# EAGLE schematic lia (EAGLE 6.1)

## Sheet 1 of 3
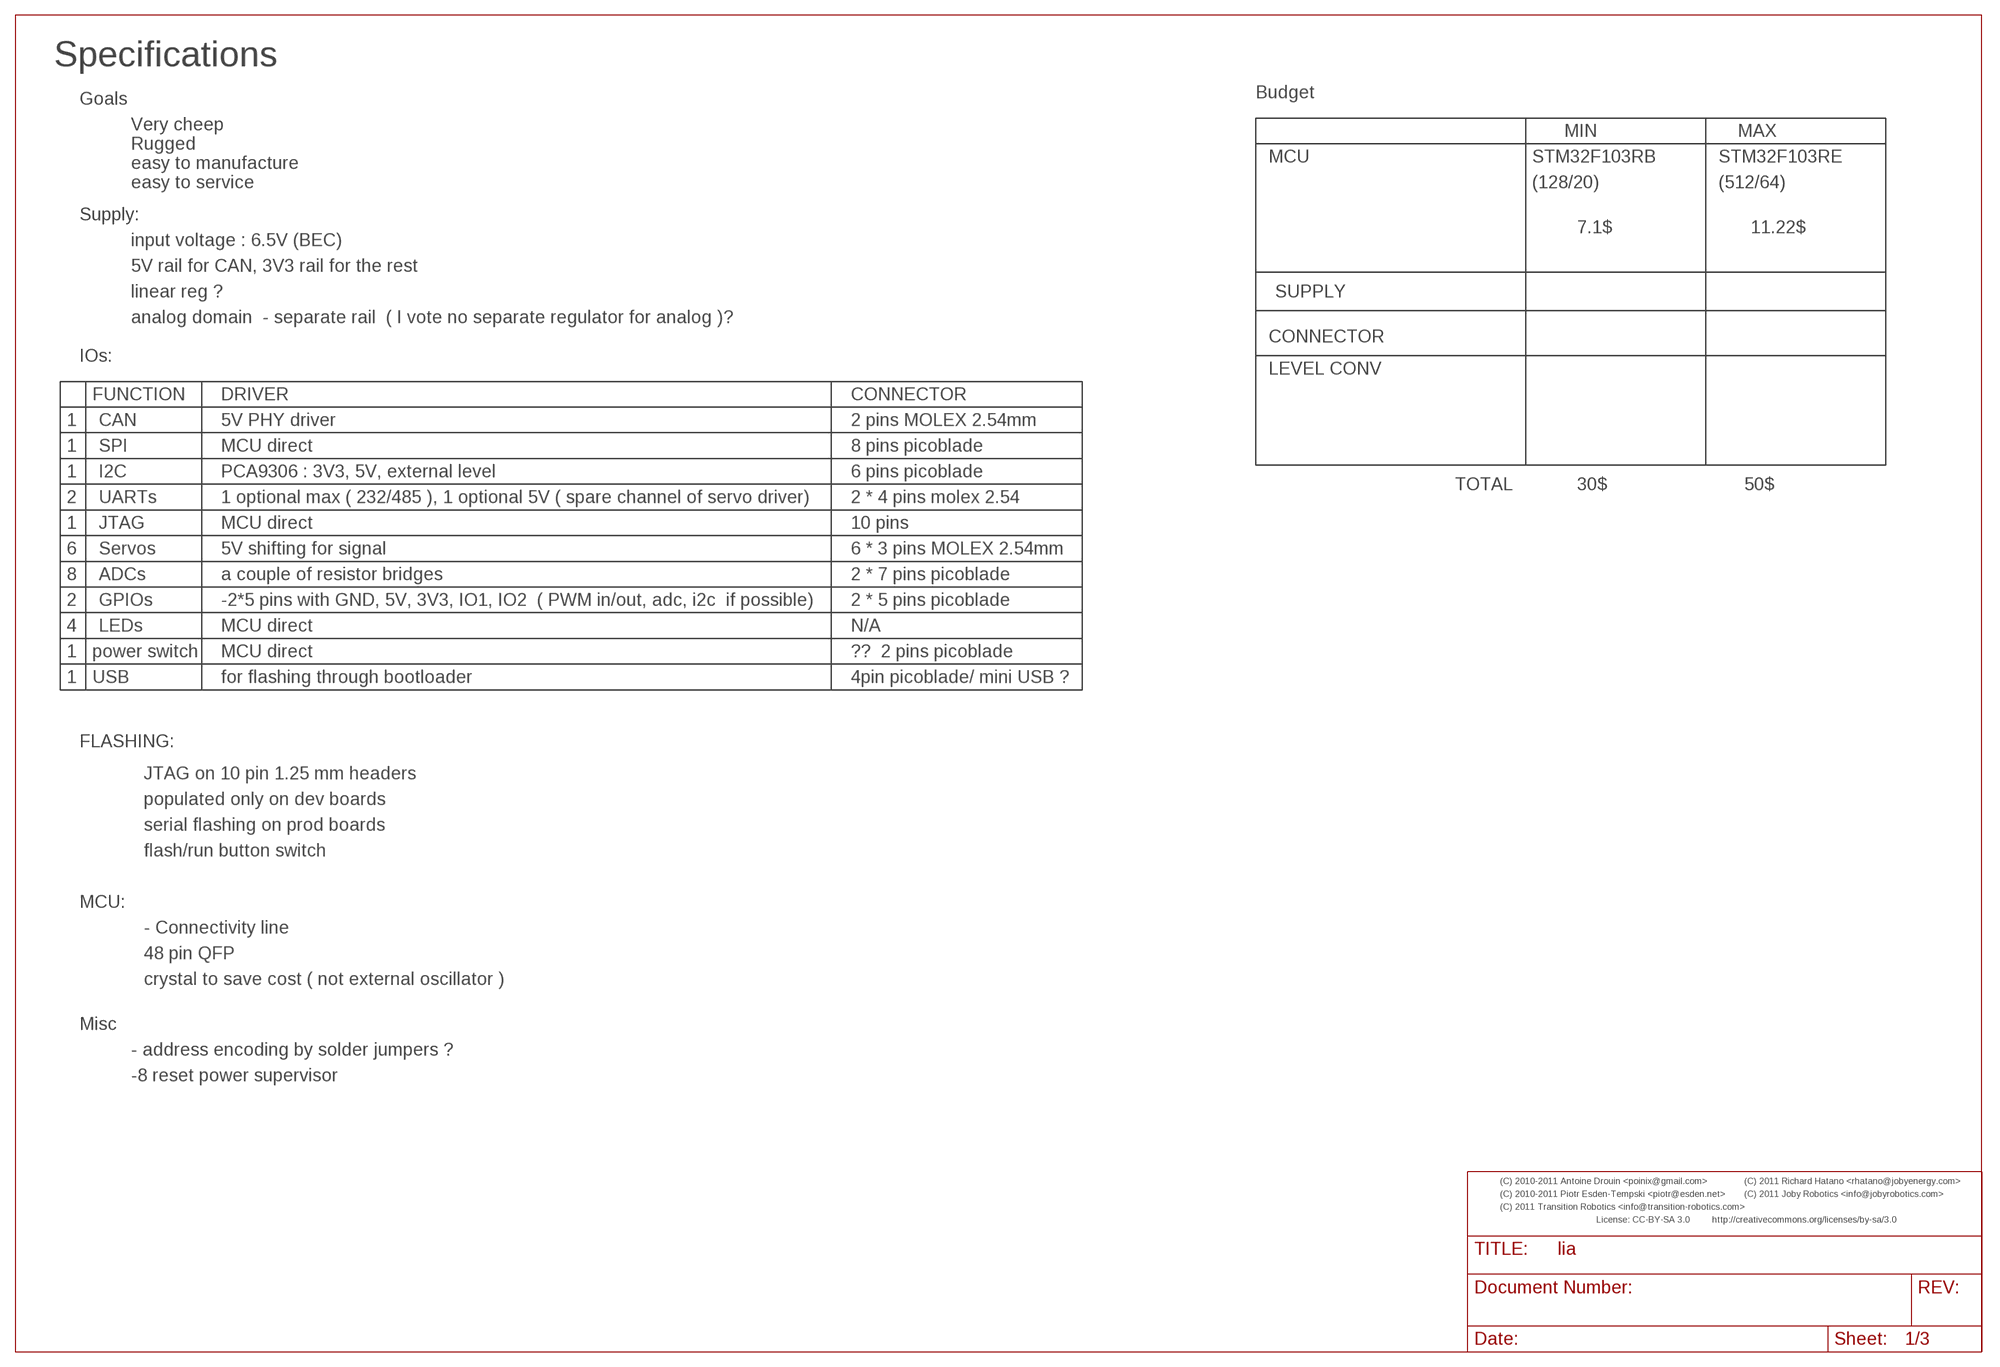
[diagram p0: schematic, sheet 1]

### Notes on the sheet
- Specifications
- Budget
- Goals
- Very cheep
- MIN | MAX
- Rugged
- MCU | STM32F103RB | STM32F103RE
- easy to manufacture
- easy to service | (128/20) | (512/64)
- Supply:
- 7.1$ | 11.22$
- input voltage : 6.5V (BEC)
- 5V rail for CAN, 3V3 rail for the rest
- linear reg ? | SUPPLY
- analog domain  - separate rail  ( I vote no separate regulator for analog )?
- CONNECTOR
- IOs:
- LEVEL CONV
- FUNCTION | DRIVER | CONNECTOR
- 1 | CAN | 5V PHY driver | 2 pins MOLEX 2.54mm
- 1 | SPI | MCU direct | 8 pins picoblade
- 1 | I2C | PCA9306 : 3V3, 5V, external level | 6 pins picoblade
- TOTAL | 30$ | 50$
- 2 | UARTs | 1 optional max ( 232/485 ), 1 optional 5V ( spare channel of servo driver) | 2 * 4 pins molex 2.54
- 1 | JTAG | MCU direct | 10 pins
- 6 | Servos | 5V shifting for signal | 6 * 3 pins MOLEX 2.54mm
- 8 | ADCs | a couple of resistor bridges | 2 * 7 pins picoblade
- 2 | GPIOs | -2*5 pins with GND, 5V, 3V3, IO1, IO2  ( PWM in/out, adc, i2c  if possible) | 2 * 5 pins picoblade
- 4 | LEDs | MCU direct | N/A
- 1 | power switch | MCU direct | ??  2 pins picoblade
- 1 | USB | for flashing through bootloader | 4pin picoblade/ mini USB ?
- FLASHING:
- JTAG on 10 pin 1.25 mm headers
- populated only on dev boards
- serial flashing on prod boards
- flash/run button switch
- MCU:
- - Connectivity line
- 48 pin QFP
- crystal to save cost ( not external oscillator )
- Misc
- - address encoding by solder jumpers ?
- -8 reset power supervisor
- (C) 2010-2011 Antoine Drouin <poinix@gmail.com> | (C) 2011 Richard Hatano <rhatano@jobyenergy.com>
- (C) 2010-2011 Piotr Esden-Tempski <piotr@esden.net> | (C) 2011 Joby Robotics <info@jobyrobotics.com>
- (C) 2011 Transition Robotics <info@transition-robotics.com>
- License: CC-BY-SA 3.0 | http://creativecommons.org/licenses/by-sa/3.0

## Sheet 2 of 3
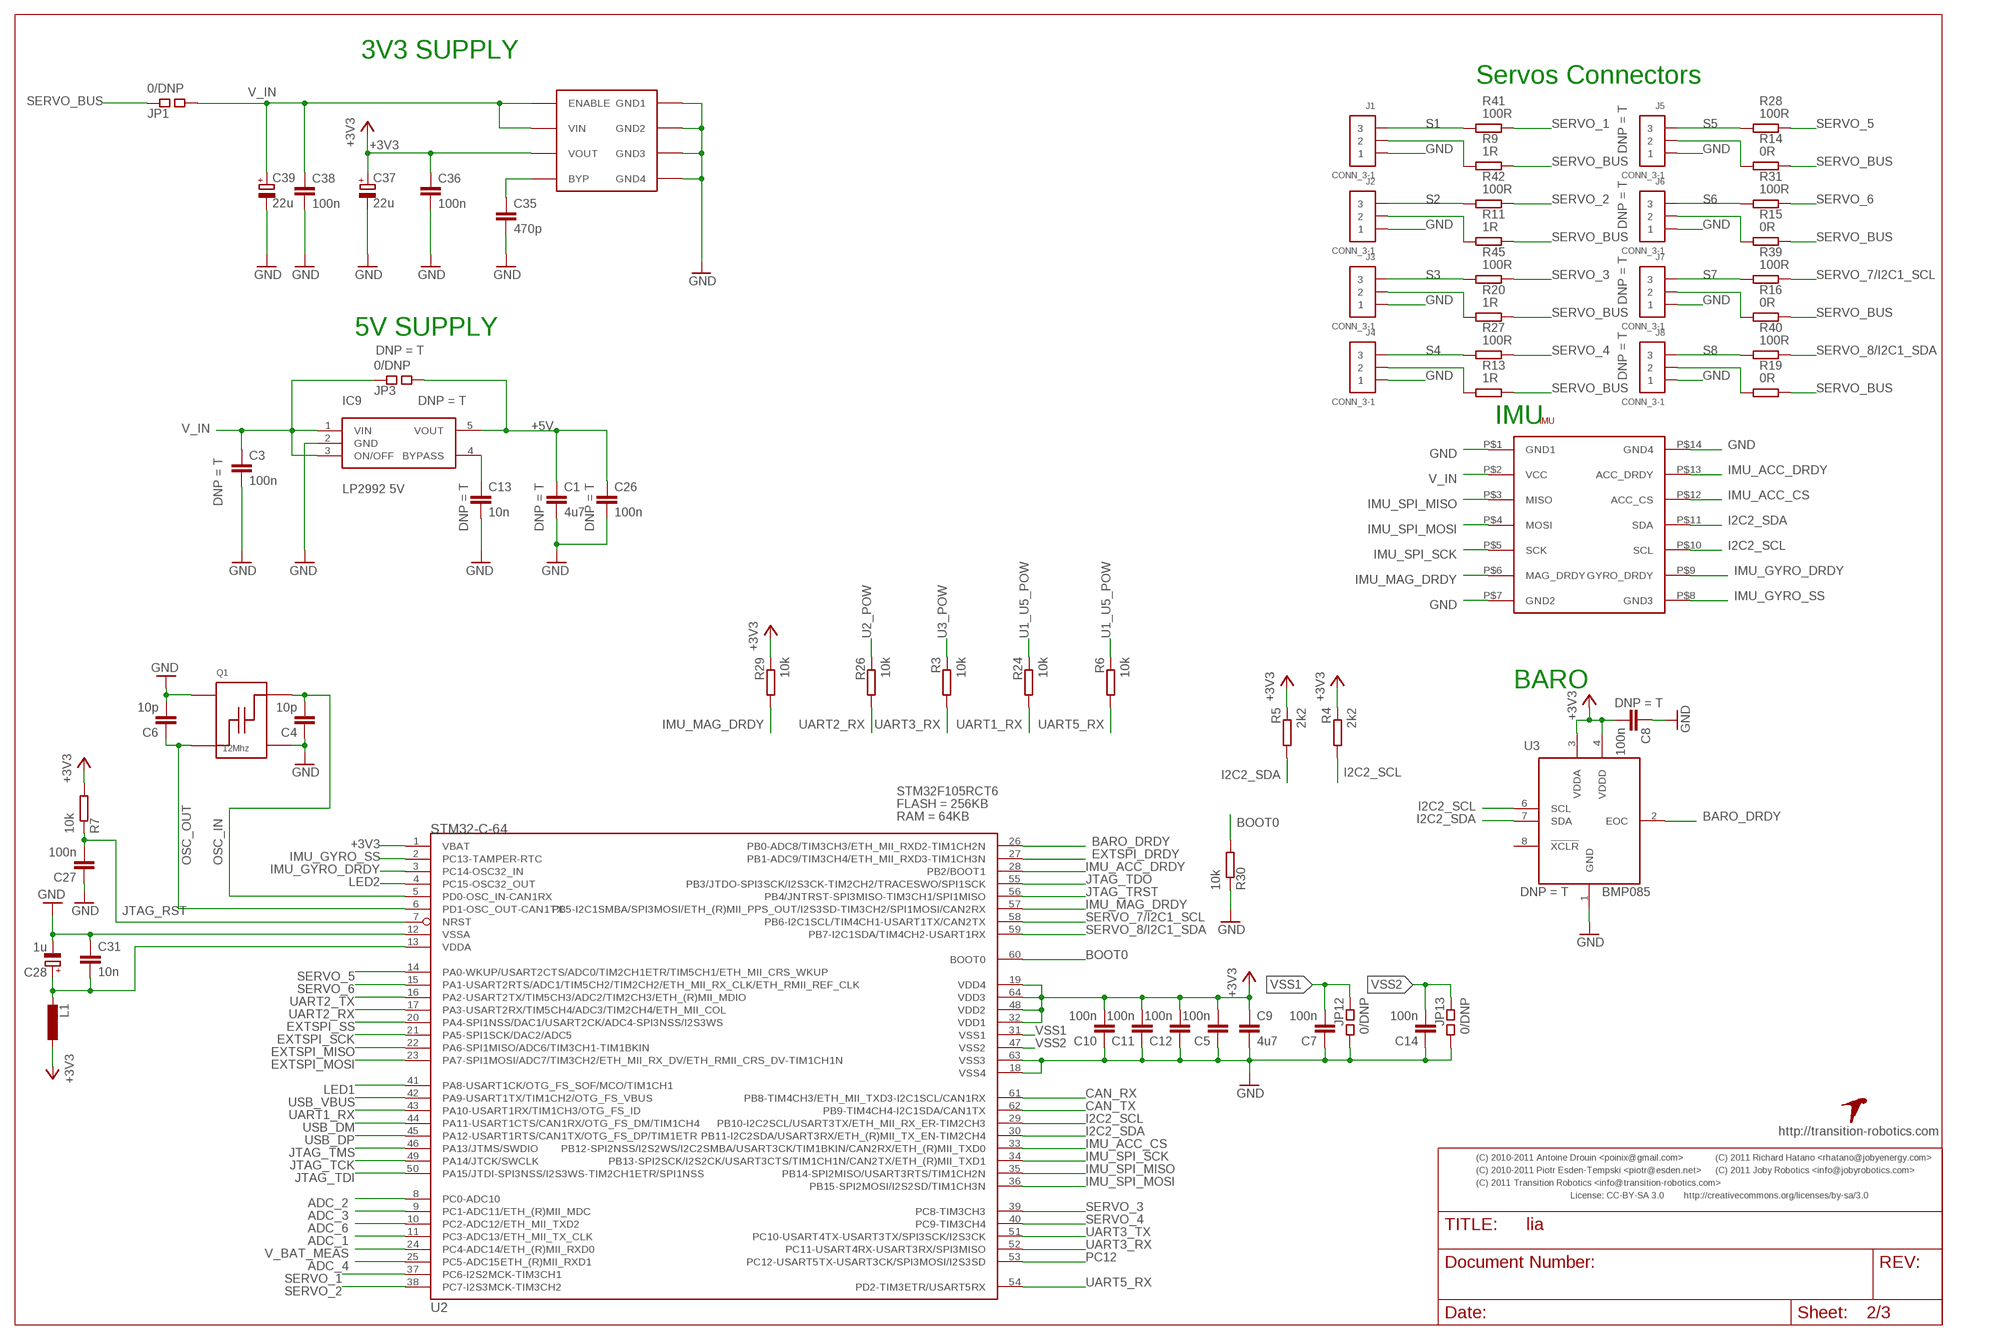
[diagram p1: schematic, sheet 2]

### Parts
C1  4u7  CAPACITOR-0805  [0805-CAP]
C3  100n  CAPACITOR-0603  [0603-CAP]
C4  10p  CAPACITOR-0402  [0402-CAP]
C5  100n  CAPACITOR-0402  [0402-CAP]
C6  10p  CAPACITOR-0402  [0402-CAP]
C7  100n  CAPACITOR-0402  [0402-CAP]
C8  100n  CAPACITOR-0402  [0402-CAP]
C9  4u7  CAPACITOR-0805  [0805-CAP]
C10  100n  CAPACITOR-0402  [0402-CAP]
C11  100n  CAPACITOR-0402  [0402-CAP]
C12  100n  CAPACITOR-0402  [0402-CAP]
C13  10n  CAPACITOR-0402  [0402-CAP]
C14  100n  CAPACITOR-0402  [0402-CAP]
C26  100n  CAPACITOR-0603  [0603-CAP]
C27  100n  CAPACITOR-0402  [0402-CAP]
C28  1u  CAPACITOR-POL-0603  [0603-POL-CAP]
C31  10n  CAPACITOR-0402  [0402-CAP]
C35  470p  CAPACITOR-0402  [0402-CAP]
C36  100n  CAPACITOR-0603  [0603-CAP]
C37  22u  CAPACITOR-POLB  [3528/B]
C38  100n  CAPACITOR-0402  [0402-CAP]
C39  22u  CAPACITOR-POLB  [3528/B]
IC9  LP2992 5V  LP2992  [SOT23-5]
IMU  ASPIRIN  [ASPIRIN_1]
J1  CONN_3-1  [SIP1X3_100]
J2  CONN_3-1  [SIP1X3_100]
J3  CONN_3-1  [SIP1X3_100]
J4  CONN_3-1  [SIP1X3_100]
J5  CONN_3-1  [SIP1X3_100]
J6  CONN_3-1  [SIP1X3_100]
J7  CONN_3-1  [SIP1X3_100]
J8  CONN_3-1  [SIP1X3_100]
JP1  0/DNP  SQ_JMP-0402  [0402-SQJMP]
JP3  0/DNP  SQ_JMP-0402  [0402-SQJMP]
JP12  0/DNP  SQ_JMP-0402  [0402-SQJMP]
JP13  0/DNP  SQ_JMP-0402  [0402-SQJMP]
L1  INDUCTOR-0603  [0603-IND]
Q1  12Mhz  ABM8  [ABM8]
R3  10k  RESISTOR-0402  [0402-RES]
R4  2k2  RESISTOR-0402  [0402-RES]
R5  2k2  RESISTOR-0402  [0402-RES]
R6  10k  RESISTOR-0402  [0402-RES]
R7  10k  RESISTOR-0402  [0402-RES]
R9  1R  RESISTOR-1206  [1206-RES]
R11  1R  RESISTOR-1206  [1206-RES]
R13  1R  RESISTOR-1206  [1206-RES]
R14  0R  RESISTOR-1206  [1206-RES]
R15  0R  RESISTOR-1206  [1206-RES]
R16  0R  RESISTOR-1206  [1206-RES]
R19  0R  RESISTOR-1206  [1206-RES]
R20  1R  RESISTOR-1206  [1206-RES]
R24  10k  RESISTOR-0402  [0402-RES]
R26  10k  RESISTOR-0402  [0402-RES]
R27  100R  RESISTOR-0402  [0402-RES]
R28  100R  RESISTOR-0402  [0402-RES]
R29  10k  RESISTOR-0402  [0402-RES]
R30  10k  RESISTOR-0402  [0402-RES]
R31  100R  RESISTOR-0402  [0402-RES]
R39  100R  RESISTOR-0402  [0402-RES]
R40  100R  RESISTOR-0402  [0402-RES]
R41  100R  RESISTOR-0402  [0402-RES]
R42  100R  RESISTOR-0402  [0402-RES]
R45  100R  RESISTOR-0402  [0402-RES]
U2  STM32-C-64  [LQFP64]
U3  BMP085  [LCC8]
U$1  TR-LOGO  [TR-LOGO]
VREG1  MIC5209  [SOIC8]

### Nets
+3V3: C5.P$2 C8.P$2 C9.P$1 C10.P$2 C11.P$2 C12.P$2 C36.P$1 C37.+ L1.P$1 R4.P$1 R5.P$1 R7.P$2 R29.P$1 U2.1(VBAT) U2.19(VDD4) U2.32(VDD1) U2.48(VDD2) U2.64(VDD3) U3.3(VDDA) U3.4(VDDD) VREG1.3(VOUT) ; also sheet 3
+5V: C1.P$1 C26.P$1 IC9.5(VOUT) JP3.P$2 ; also sheet 3
ADC_1: U2.11(PC3-ADC13/ETH_MII_TX_CLK) ; also sheet 3
ADC_2: U2.8(PC0-ADC10) ; also sheet 3
ADC_3: U2.9(PC1-ADC11/ETH_(R)MII_MDC) ; also sheet 3
ADC_4: U2.25(PC5-ADC15ETH_(R)MII_RXD1) ; also sheet 3
ADC_6: U2.10(PC2-ADC12/ETH_MII_TXD2) ; also sheet 3
BARO_DRDY: U2.26(PB0-ADC8/TIM3CH3/ETH_MII_RXD2-TIM1CH2N) U3.2(EOC)
BOOT0: R30.P$2 U2.60(BOOT0) ; also sheet 3
CAN_RX: U2.61(PB8-TIM4CH3/ETH_MII_TXD3-I2C1SCL/CAN1RX) ; also sheet 3
CAN_TX: U2.62(PB9-TIM4CH4-I2C1SDA/CAN1TX) ; also sheet 3
EXTSPI_DRDY: U2.27(PB1-ADC9/TIM3CH4/ETH_MII_RXD3-TIM1CH3N) ; also sheet 3
EXTSPI_MISO: U2.22(PA6-SPI1MISO/ADC6/TIM3CH1-TIM1BKIN) ; also sheet 3
EXTSPI_MOSI: U2.23(PA7-SPI1MOSI/ADC7/TIM3CH2/ETH_MII_RX_DV/ETH_RMII_CRS_DV-TIM1CH1N) ; also sheet 3
EXTSPI_SCK: U2.21(PA5-SPI1SCK/DAC2/ADC5) ; also sheet 3
EXTSPI_SS: U2.20(PA4-SPI1NSS/DAC1/USART2CK/ADC4-SPI3NSS/I2S3WS) ; also sheet 3
GND: C1.P$2 C3.P$2 C4.P$1 C5.P$1 C6.P$2 C7.P$1 C8.P$1 C9.P$2 C10.P$1 C11.P$1 C12.P$1 C13.P$2 C14.P$1 C26.P$2 C27.P$1 C28.- C31.P$1 C35.P$2 C36.P$2 C37.- C38.P$2 C39.- IC9.2(GND) IMU.P$1(GND1) IMU.P$7(GND2) IMU.P$14(GND4) J1.1 J2.1 J3.1 J4.1 J5.1 J6.1 J7.1 J8.1 JP12.P$2 JP13.P$2 Q1.P$2 Q1.P$4 R30.P$1 U2.12(VSSA) U2.18(VSS4) U2.63(VSS3) U3.1(GND) VREG1.5(GND4) VREG1.6(GND3) VREG1.7(GND2) VREG1.8(GND1) ; also sheet 3
I2C2_SCL: IMU.P$10(SCL) R4.P$2 U2.29(PB10-I2C2SCL/USART3TX/ETH_MII_RX_ER-TIM2CH3) U3.6(SCL) ; also sheet 3
I2C2_SDA: IMU.P$11(SDA) R5.P$2 U2.30(PB11-I2C2SDA/USART3RX/ETH_(R)MII_TX_EN-TIM2CH4) U3.7(SDA) ; also sheet 3
IMU_ACC_CS: IMU.P$12(ACC_CS) U2.33(PB12-SPI2NSS/I2S2WS/I2C2SMBA/USART3CK/TIM1BKIN/CAN2RX/ETH_(R)MII_TXD0)
IMU_ACC_DRDY: IMU.P$13(ACC_DRDY) U2.28(PB2/BOOT1)
IMU_GYRO_DRDY: IMU.P$9(GYRO_DRDY) U2.3(PC14-OSC32_IN)
IMU_GYRO_SS: IMU.P$8(GND3) U2.2(PC13-TAMPER-RTC)
IMU_MAG_DRDY: IMU.P$6(MAG_DRDY) R29.P$2 U2.57(PB5-I2C1SMBA/SPI3MOSI/ETH_(R)MII_PPS_OUT/I2S3SD-TIM3CH2/SPI1MOSI/CAN2RX)
IMU_SPI_MISO: IMU.P$3(MISO) U2.35(PB14-SPI2MISO/USART3RTS/TIM1CH2N)
IMU_SPI_MOSI: IMU.P$4(MOSI) U2.36(PB15-SPI2MOSI/I2S2SD/TIM1CH3N)
IMU_SPI_SCK: IMU.P$5(SCK) U2.34(PB13-SPI2SCK/I2S2CK/USART3CTS/TIM1CH1N/CAN2TX/ETH_(R)MII_TXD1)
JTAG_RST: C27.P$2 R7.P$1 U2.7(NRST) ; also sheet 3
JTAG_TCK: U2.49(PA14/JTCK/SWCLK) ; also sheet 3
JTAG_TDI: U2.50(PA15/JTDI-SPI3NSS/I2S3WS-TIM2CH1ETR/SPI1NSS) ; also sheet 3
JTAG_TDO: U2.55(PB3/JTDO-SPI3SCK/I2S3CK-TIM2CH2/TRACESWO/SPI1SCK) ; also sheet 3
JTAG_TMS: U2.46(PA13/JTMS/SWDIO) ; also sheet 3
JTAG_TRST: U2.56(PB4/JNTRST-SPI3MISO-TIM3CH1/SPI1MISO) ; also sheet 3
LED1: U2.41(PA8-USART1CK/OTG_FS_SOF/MCO/TIM1CH1) ; also sheet 3
LED2: U2.4(PC15-OSC32_OUT) ; also sheet 3
N$2: J5.2 R14.P$1
N$3: J6.2 R15.P$1
N$6: C13.P$1 IC9.4(BYPASS)
N$7: C35.P$1 VREG1.4(BYP)
N$16: J7.2 R16.P$1
N$17: J8.2 R19.P$1
N$18: J4.2 R13.P$1
N$19: J3.2 R20.P$1
N$20: J2.2 R11.P$1
N$21: J1.2 R9.P$1
OSC_IN: C4.P$2 Q1.P$3 U2.5(PD0-OSC_IN-CAN1RX)
OSC_OUT: C6.P$1 Q1.P$1 U2.6(PD1-OSC_OUT-CAN1TX)
PC12: U2.53(PC12-USART5TX-USART3CK/SPI3MOSI/I2S3SD) ; also sheet 3
S1: J1.3 R41.P$1
S2: J2.3 R42.P$1
S3: J3.3 R45.P$1
S4: J4.3 R27.P$1
S5: J5.3 R28.P$1
S6: J6.3 R31.P$1
S7: J7.3 R39.P$1
S8: J8.3 R40.P$1
SERVO_1: R41.P$2 U2.37(PC6-I2S2MCK-TIM3CH1)
SERVO_2: R42.P$2 U2.38(PC7-I2S3MCK-TIM3CH2)
SERVO_3: R45.P$2 U2.39(PC8-TIM3CH3)
SERVO_4: R27.P$2 U2.40(PC9-TIM3CH4)
SERVO_5: R28.P$2 U2.14(PA0-WKUP/USART2CTS/ADC0/TIM2CH1ETR/TIM5CH1/ETH_MII_CRS_WKUP)
SERVO_6: R31.P$2 U2.15(PA1-USART2RTS/ADC1/TIM5CH2/TIM2CH2/ETH_MII_RX_CLK/ETH_RMII_REF_CLK)
SERVO_7/I2C1_SCL: R39.P$2 U2.58(PB6-I2C1SCL/TIM4CH1-USART1TX/CAN2TX) ; also sheet 3
SERVO_8/I2C1_SDA: R40.P$2 U2.59(PB7-I2C1SDA/TIM4CH2-USART1RX) ; also sheet 3
SERVO_BUS: JP1.P$1 R9.P$2 R11.P$2 R13.P$2 R14.P$2 R15.P$2 R16.P$2 R19.P$2 R20.P$2
U1_U5_POW: R6.P$1 R24.P$1 ; also sheet 3
U2_POW: R26.P$1 ; also sheet 3
U3_POW: R3.P$1 ; also sheet 3
UART1_RX: R24.P$2 U2.43(PA10-USART1RX/TIM1CH3/OTG_FS_ID) ; also sheet 3
UART2_RX: R26.P$2 U2.17(PA3-USART2RX/TIM5CH4/ADC3/TIM2CH4/ETH_MII_COL) ; also sheet 3
UART2_TX: U2.16(PA2-USART2TX/TIM5CH3/ADC2/TIM2CH3/ETH_(R)MII_MDIO) ; also sheet 3
UART3_RX: R3.P$2 U2.52(PC11-USART4RX-USART3RX/SPI3MISO) ; also sheet 3
UART3_TX: U2.51(PC10-USART4TX-USART3TX/SPI3SCK/I2S3CK) ; also sheet 3
UART5_RX: R6.P$2 U2.54(PD2-TIM3ETR/USART5RX) ; also sheet 3
USB_DM: U2.44(PA11-USART1CTS/CAN1RX/OTG_FS_DM/TIM1CH4) ; also sheet 3
USB_DP: U2.45(PA12-USART1RTS/CAN1TX/OTG_FS_DP/TIM1ETR) ; also sheet 3
USB_VBUS: U2.42(PA9-USART1TX/TIM1CH2/OTG_FS_VBUS) ; also sheet 3
V_BAT_MEAS: U2.24(PC4-ADC14/ETH_(R)MII_RXD0) ; also sheet 3
V_IN: C3.P$1 C38.P$1 C39.+ IC9.1(VIN) IC9.3(ON/OFF) IMU.P$2(VCC) JP1.P$2 JP3.P$1 VREG1.1(ENABLE) VREG1.2(VIN) ; also sheet 3
VDDA: C28.+ C31.P$2 L1.P$2 U2.13(VDDA)
VSS1: C7.P$2 JP12.P$1 U2.31(VSS1)
VSS2: C14.P$2 JP13.P$1 U2.47(VSS2)
Unconnected: U3.8(!XCLR)

### Notes on the sheet
- 3V3 SUPPLY
- Servos Connectors
- 5V SUPPLY
- IMU
- BARO
- http://transition-robotics.com
- (C) 2010-2011 Antoine Drouin <poinix@gmail.com> | (C) 2011 Richard Hatano <rhatano@jobyenergy.com>
- (C) 2010-2011 Piotr Esden-Tempski <piotr@esden.net> | (C) 2011 Joby Robotics <info@jobyrobotics.com>
- (C) 2011 Transition Robotics <info@transition-robotics.com>
- License: CC-BY-SA 3.0 | http://creativecommons.org/licenses/by-sa/3.0

## Sheet 3 of 3
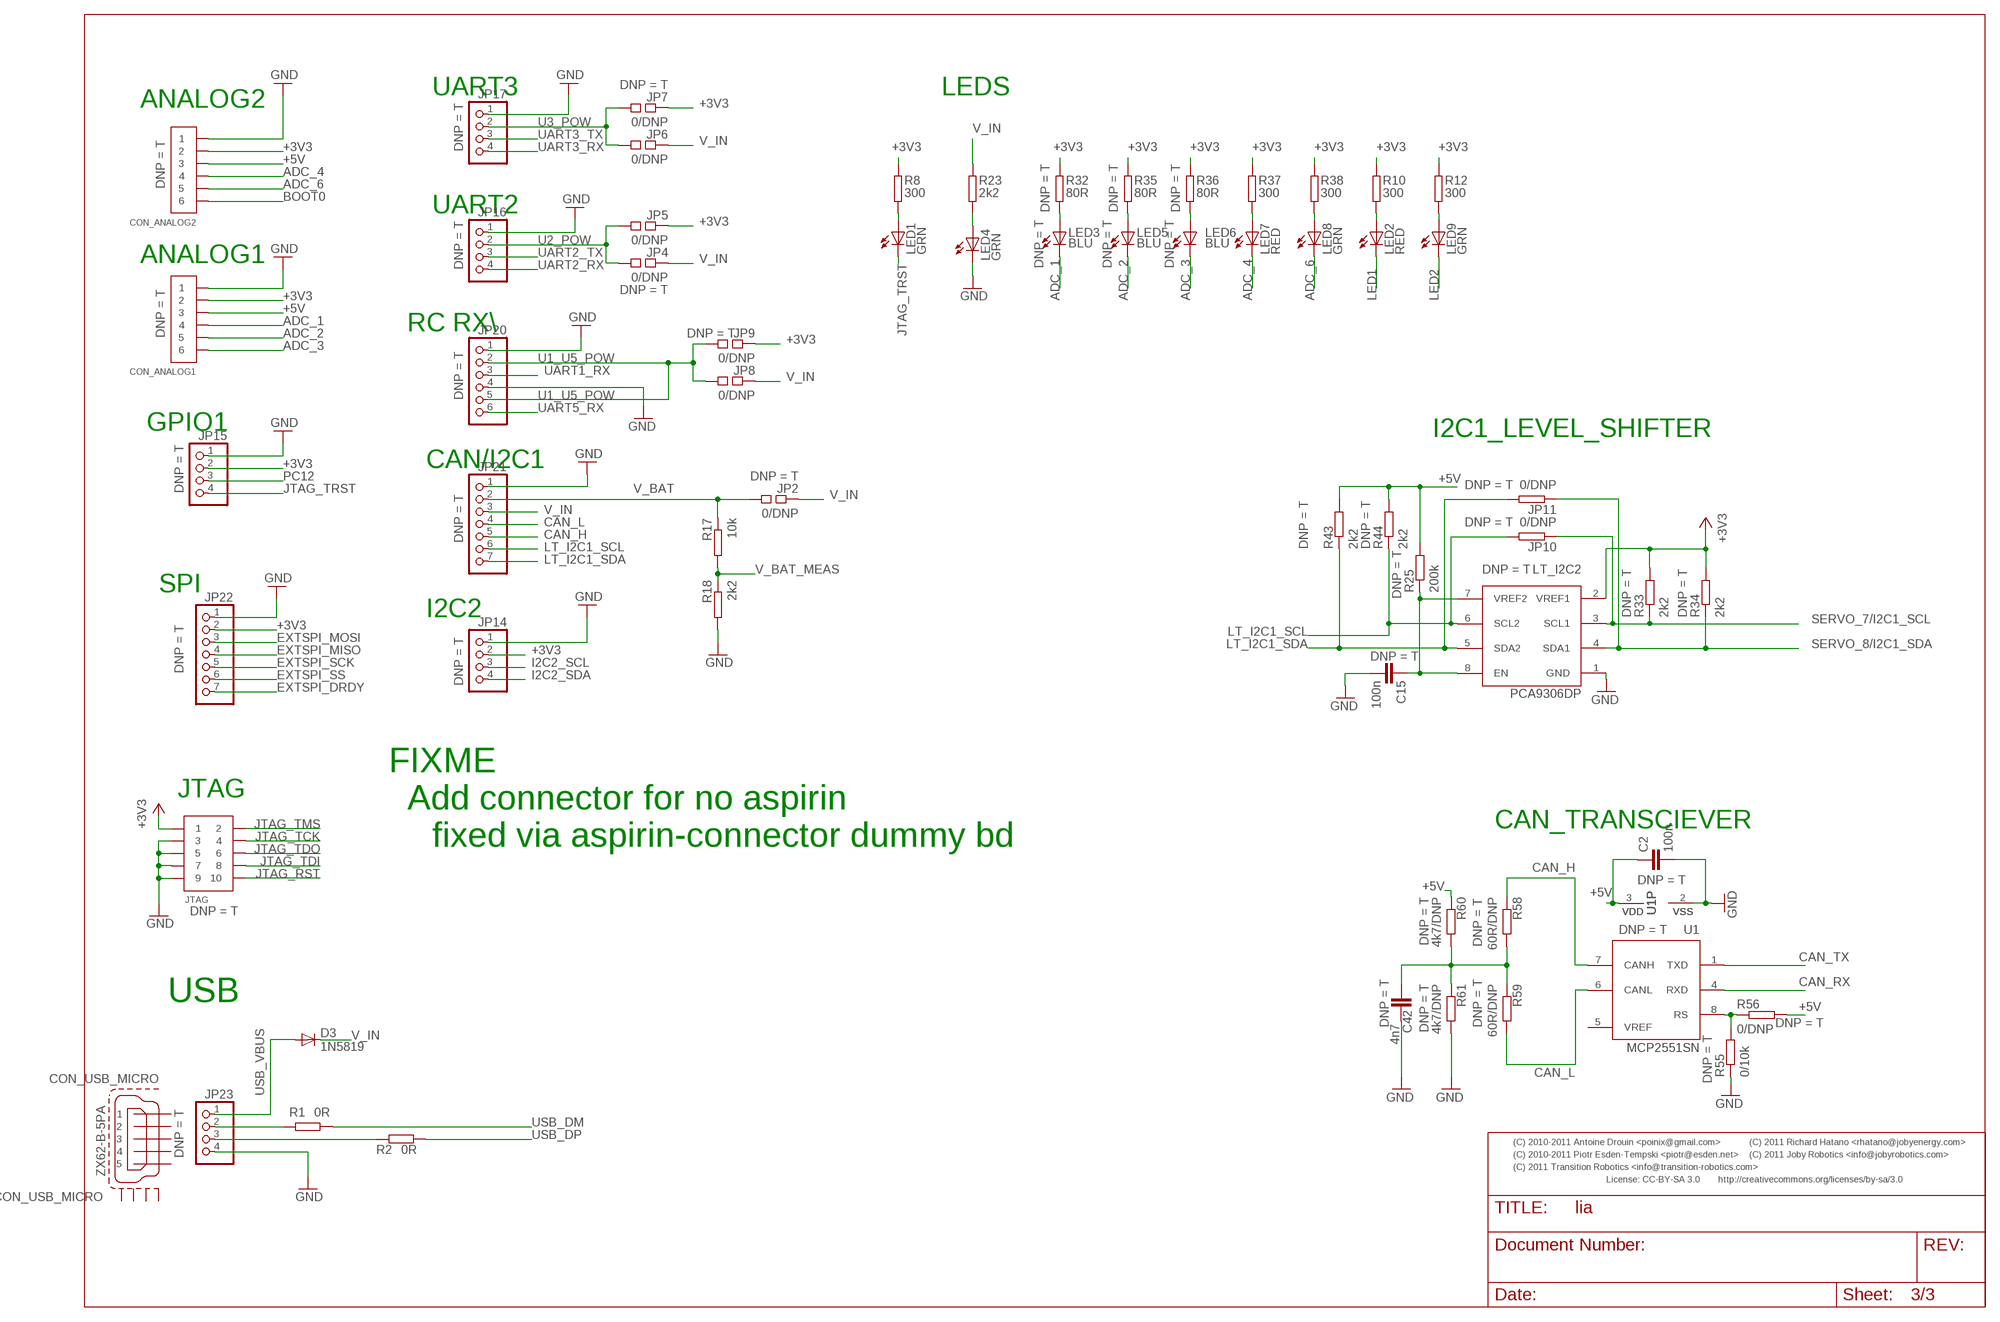
[diagram p2: schematic, sheet 3]

### Parts
C2  100n  CAPACITOR-0402  [0402-CAP]
C15  100n  CAPACITOR-0402  [0402-CAP]
C42  4n7  CAPACITOR-0603  [0603-CAP]
CON_ANALOG1  CONN_6-1-53398  [PB-53398-06]
CON_ANALOG2  CONN_6-1-53398  [PB-53398-06]
CON_USB_MICRO  ZX62-B-5PA  [ZX62-B-5PA]
D3  1N5819  DIODE-MICROMELF-R  [MICROMELF-R]
JP2  0/DNP  SQ_JMP-0402  [0402-SQJMP]
JP4  0/DNP  SQ_JMP-0402  [0402-SQJMP]
JP5  0/DNP  SQ_JMP-0402  [0402-SQJMP]
JP6  0/DNP  SQ_JMP-0402  [0402-SQJMP]
JP7  0/DNP  SQ_JMP-0402  [0402-SQJMP]
JP8  0/DNP  SQ_JMP-0402  [0402-SQJMP]
JP9  0/DNP  SQ_JMP-0402  [0402-SQJMP]
JP10  0/DNP  RESISTOR-0603  [0603-RES]
JP11  0/DNP  RESISTOR-0603  [0603-RES]
JP14  PINHD-1X4  [1X04]
JP15  PINHD-1X4  [1X04]
JP16  PINHD-1X4  [1X04]
JP17  PINHD-1X4  [1X04]
JP20  PINHD-1X6  [1X06]
JP21  PINHD-1X7  [1X07]
JP22  PINHD-1X7  [1X07]
JP23  PINHD-1X4  [1X04]
JTAG  PIN_HDR_EDG_1.27MM_5-2  CONN_5-2-FTSH-V  [FTSH-105-DV]
LED1  GRN  LED-0402  [0402-LED]
LED2  RED  LED-0402  [0402-LED]
LED3  BLU  LED-0402  [0402-LED]
LED4  GRN  LED-0402  [0402-LED]
LED5  BLU  LED-0402  [0402-LED]
LED6  BLU  LED-0402  [0402-LED]
LED7  RED  LED-0402  [0402-LED]
LED8  GRN  LED-0402  [0402-LED]
LED9  GRN  LED-0402  [0402-LED]
LT_I2C2  PCA9306DP  [TSSOP_B3]
R1  0R  RESISTOR-0402  [0402-RES]
R2  0R  RESISTOR-0402  [0402-RES]
R8  300  RESISTOR-0402  [0402-RES]
R10  300  RESISTOR-0402  [0402-RES]
R12  300  RESISTOR-0402  [0402-RES]
R17  10k  RESISTOR-0402  [0402-RES]
R18  2k2  RESISTOR-0402  [0402-RES]
R23  2k2  RESISTOR-0402  [0402-RES]
R25  200k  RESISTOR-0402  [0402-RES]
R32  80R  RESISTOR-0402  [0402-RES]
R33  2k2  RESISTOR-0402  [0402-RES]
R34  2k2  RESISTOR-0402  [0402-RES]
R35  80R  RESISTOR-0402  [0402-RES]
R36  80R  RESISTOR-0402  [0402-RES]
R37  300  RESISTOR-0402  [0402-RES]
R38  300  RESISTOR-0402  [0402-RES]
R43  2k2  RESISTOR-0402  [0402-RES]
R44  2k2  RESISTOR-0402  [0402-RES]
R55  0/10k  RESISTOR-0402  [0402-RES]
R56  0/DNP  RESISTOR-0402  [0402-RES]
R58  60R/DNP  RESISTOR-0402  [0402-RES]
R59  60R/DNP  RESISTOR-0402  [0402-RES]
R60  4k7/DNP  RESISTOR-0402  [0402-RES]
R61  4k7/DNP  RESISTOR-0402  [0402-RES]
U1  MCP2551SN  [SO-08]

### Nets
+3V3: CON_ANALOG1.2 CON_ANALOG2.2 JP5.P$1 JP7.P$1 JP9.P$1 JP14.2 JP15.2 JP22.2 JTAG.1 LT_I2C2.2(VREF1) R8.P$2 R10.P$2 R12.P$2 R32.P$2 R33.P$2 R34.P$2 R35.P$2 R36.P$2 R37.P$2 R38.P$2 ; also sheet 2
+5V: C2.P$1 CON_ANALOG1.3 CON_ANALOG2.3 R25.P$2 R43.P$2 R44.P$2 R56.P$2 R60.P$1 U1.3(VDD) ; also sheet 2
ADC_1: CON_ANALOG1.4 LED3.C ; also sheet 2
ADC_2: CON_ANALOG1.5 LED5.C ; also sheet 2
ADC_3: CON_ANALOG1.6 LED6.C ; also sheet 2
ADC_4: CON_ANALOG2.4 LED7.C ; also sheet 2
ADC_6: CON_ANALOG2.5 LED8.C ; also sheet 2
BOOT0: CON_ANALOG2.6 ; also sheet 2
CAN_CENTER: C42.P$2 R58.P$2 R59.P$1 R60.P$2 R61.P$1
CAN_H: JP21.5 R58.P$1 U1.7(CANH)
CAN_L: JP21.4 R59.P$2 U1.6(CANL)
CAN_RX: U1.4(RXD) ; also sheet 2
CAN_TX: U1.1(TXD) ; also sheet 2
EXTSPI_DRDY: JP22.7 ; also sheet 2
EXTSPI_MISO: JP22.4 ; also sheet 2
EXTSPI_MOSI: JP22.3 ; also sheet 2
EXTSPI_SCK: JP22.5 ; also sheet 2
EXTSPI_SS: JP22.6 ; also sheet 2
FT_USB_DM: JP23.2 R1.P$1
FT_USB_DP: JP23.3 R2.P$1
GND: C2.P$2 C15.P$2 C42.P$1 CON_ANALOG1.1 CON_ANALOG2.1 JP14.1 JP15.1 JP16.1 JP17.1 JP20.1 JP20.4 JP21.1 JP22.1 JP23.4 JTAG.3 JTAG.5 JTAG.7 JTAG.9 LED4.C LT_I2C2.1(GND) R18.P$2 R55.P$1 R61.P$2 U1.2(VSS) ; also sheet 2
I2C2_SCL: JP14.3 ; also sheet 2
I2C2_SDA: JP14.4 ; also sheet 2
JTAG_RST: JTAG.10 ; also sheet 2
JTAG_TCK: JTAG.4 ; also sheet 2
JTAG_TDI: JTAG.8 ; also sheet 2
JTAG_TDO: JTAG.6 ; also sheet 2
JTAG_TMS: JTAG.2 ; also sheet 2
JTAG_TRST: JP15.4 LED1.C ; also sheet 2
LED1: LED2.C ; also sheet 2
LED2: LED9.C ; also sheet 2
LT_I2C1_SCL: JP10.P$2 JP21.6 LT_I2C2.6(SCL2) R44.P$1
LT_I2C1_SDA: JP11.P$2 JP21.7 LT_I2C2.5(SDA2) R43.P$1
N$1: R55.P$2 R56.P$1 U1.8(RS)
N$4: LED2.A R10.P$1
N$5: LED3.A R32.P$1
N$8: C15.P$1 LT_I2C2.7(VREF2) LT_I2C2.8(EN) R25.P$1
N$9: LED5.A R35.P$1
N$10: LED1.A R8.P$1
N$11: LED6.A R36.P$1
N$12: LED4.A R23.P$1
N$13: LED9.A R12.P$1
N$14: LED7.A R37.P$1
N$15: LED8.A R38.P$1
PC12: JP15.3 ; also sheet 2
SERVO_7/I2C1_SCL: JP10.P$1 LT_I2C2.3(SCL1) R33.P$1 ; also sheet 2
SERVO_8/I2C1_SDA: JP11.P$1 LT_I2C2.4(SDA1) R34.P$1 ; also sheet 2
U1_U5_POW: JP8.P$2 JP9.P$2 JP20.2 JP20.5 ; also sheet 2
U2_POW: JP4.P$2 JP5.P$2 JP16.2 ; also sheet 2
U3_POW: JP6.P$2 JP7.P$2 JP17.2 ; also sheet 2
UART1_RX: JP20.3 ; also sheet 2
UART2_RX: JP16.4 ; also sheet 2
UART2_TX: JP16.3 ; also sheet 2
UART3_RX: JP17.4 ; also sheet 2
UART3_TX: JP17.3 ; also sheet 2
UART5_RX: JP20.6 ; also sheet 2
USB_DM: R1.P$2 ; also sheet 2
USB_DP: R2.P$2 ; also sheet 2
USB_VBUS: D3.A JP23.1 ; also sheet 2
V_BAT: JP2.P$2 JP21.2 R17.P$1
V_BAT_MEAS: R17.P$2 R18.P$1 ; also sheet 2
V_IN: D3.C JP2.P$1 JP4.P$1 JP6.P$1 JP8.P$1 JP21.3 R23.P$2 ; also sheet 2
Unconnected: CON_USB_MICRO.GND_LEFT(S1) CON_USB_MICRO.GND_RIGHT(S2) CON_USB_MICRO.GND_UP_LEFT(S3) CON_USB_MICRO.GND_UP_RIGHT(S4) CON_USB_MICRO.PIN_1 CON_USB_MICRO.PIN_2 CON_USB_MICRO.PIN_3 CON_USB_MICRO.PIN_4 CON_USB_MICRO.PIN_5

### Notes on the sheet
- ANALOG2 | UART3 | LEDS
- UART2
- ANALOG1
- RC RX\
- GPIO1 | I2C1_LEVEL_SHIFTER
- CAN/I2C1
- SPI
- I2C2
- FIXME
- JTAG
- Add connector for no aspirin
- CAN_TRANSCIEVER
- fixed via aspirin-connector dummy bd
- USB
- (C) 2010-2011 Antoine Drouin <poinix@gmail.com> | (C) 2011 Richard Hatano <rhatano@jobyenergy.com>
- (C) 2010-2011 Piotr Esden-Tempski <piotr@esden.net> | (C) 2011 Joby Robotics <info@jobyrobotics.com>
- (C) 2011 Transition Robotics <info@transition-robotics.com>
- License: CC-BY-SA 3.0 | http://creativecommons.org/licenses/by-sa/3.0

## Power pins joined to a net without a drawn wire
VREF: U1.5(VREF)

## Library data of the parts
C1 = pel_dipol_comp:CAPACITOR; DNP: T; PARTNO: cap-cer-0805-4u7
C2 C8 C15 = pel_dipol_comp:CAPACITOR; DNP: T; PARTNO: cap-cer-0402-100n
C3 C26 = pel_dipol_comp:CAPACITOR; DNP: T; PARTNO: cap-cer-0603-100n
C4 C6 = pel_dipol_comp:CAPACITOR; PARTNO: cap-cer-0402-10p
C5 C7 C10-C12 C14 C27 C38 = pel_dipol_comp:CAPACITOR; PARTNO: cap-cer-0402-100n
C9 = pel_dipol_comp:CAPACITOR; PARTNO: cap-cer-0805-4u7
C13 = pel_dipol_comp:CAPACITOR; DNP: T; PARTNO: cap-cer-0402-10n
C28 = pel_dipol_comp:CAPACITOR-POL; PARTNO: cap-tan-0603-1u
C31 = pel_dipol_comp:CAPACITOR; PARTNO: cap-cer-0402-10n
C35 = pel_dipol_comp:CAPACITOR; PARTNO: cap-cer-0402-470p
C36 = pel_dipol_comp:CAPACITOR; PARTNO: cap-cer-0603-100n
C37 C39 = pel_dipol_comp:CAPACITOR-POL; PARTNO: cap-tan-B-22u-16v
C42 = pel_dipol_comp:CAPACITOR; DNP: T; PARTNO: cap-cer-0603-4n7
CON_ANALOG1 CON_ANALOG2 = pel_molex:CONN_6-1; DNP: T; PARTNO: conn-picoblade-smd-0.05in-6-vert
CON_USB_MICRO = open-bldc:ZX62-B-5PA; PARTNO: conn-smd-usb-micro-b
D3 = diode:DIODE-: DIODE; PARTNO: diode-schottky-1608
IC9 = open-bldc:LP2992; DNP: T; PARTNO: vreg-sot-23-5-5v
IMU = joby_robotics:ASPIRIN; PARTNO: pcb-ass-aspirin
J1-J4 = pel_misc:CONN_3-1; PARTNO: conn-th-0.1in-3-2-ra
J5-J8 = pel_misc:CONN_3-1; DNP: T; PARTNO: conn-th-0.1in-3-2-ra
JP1 JP5 JP6 JP8 JP12 JP13 = pel_jumpers:SQ_JMP; PARTNO: res-0402-0
JP2-JP4 JP7 JP9 = pel_jumpers:SQ_JMP; DNP: T; PARTNO: res-0402-0
JP10 JP11 = pel_dipol_comp:RESISTOR; DNP: T; PARTNO: res-0603-0
JP14-JP17 JP23 = pinhead:PINHD-1X4: PIN HEADER; DNP: T; PARTNO: conn-th-0.1in-4-1
JP20 = pinhead:PINHD-1X6: PIN HEADER; DNP: T; PARTNO: conn-th-0.1in-6-1
JP21 JP22 = pinhead:PINHD-1X7: PIN HEADER; DNP: T; PARTNO: conn-th-0.1in-7-1
JTAG = pel_misc:CONN_5-2; DNP: T; PARTNO: conn-smd-0.05in-5-2
L1 = res_cap:INDUCTOR; PARTNO: ferrite-0603-600ohm
LED1 LED4 LED8 LED9 = pel_dipol_comp:LED; PARTNO: led-0402-green
LED2 LED7 = pel_dipol_comp:LED; PARTNO: led-0402-red
LED3 LED5 LED6 = pel_dipol_comp:LED; DNP: T; PARTNO: led-0402-blue
LT_I2C2 = booz:PCA9306: Dual bidirectional I2C-bus and SMBus voltage-level translator; DNP: T; PARTNO: ic-tssop8-level-trans
Q1 = booz:ABM8; PARTNO: xtal-abm8-12mhz
R1 R2 = pel_dipol_comp:RESISTOR; PARTNO: res-0402-0
R3 R6 R7 R17 R24 R26 R29 R30 = pel_dipol_comp:RESISTOR; PARTNO: res-0402-10k
R4 R5 R18 R23 = pel_dipol_comp:RESISTOR; PARTNO: res-0402-2k2
R8 R10 R12 R37 R38 = pel_dipol_comp:RESISTOR; PARTNO: res-0402-300
R9 R11 R13 R20 = pel_dipol_comp:RESISTOR; PARTNO: res-1206-1
R14-R16 R19 = pel_dipol_comp:RESISTOR; PARTNO: res-1206-0
R25 = pel_dipol_comp:RESISTOR; DNP: T; PARTNO: res-0402-200k
R27 R28 R31 R39-R42 R45 = pel_dipol_comp:RESISTOR; PARTNO: res-0402-100
R32 R35 R36 = pel_dipol_comp:RESISTOR; DNP: T; PARTNO: res-0402-80
R33 R34 = pel_dipol_comp:RESISTOR; DNP: T; PARTNO: res-0402-2k2
R43 R44 = pel_dipol_comp:RESISTOR; DNP: T; PARTNO: res-0402-1k5
R55 = pel_dipol_comp:RESISTOR; DNP: T; PARTNO: res-0402-10k
R56 = pel_dipol_comp:RESISTOR; DNP: T; PARTNO: res-0402-0
R58 R59 = pel_dipol_comp:RESISTOR; DNP: T; PARTNO: res-0402-60.4
R60 R61 = pel_dipol_comp:RESISTOR; DNP: T; PARTNO: res-0402-4k7
U1 = microchip_can:MCP2551: High Speed CAN tranceiver; DNP: T; PARTNO: ic-so8-can
U2 = pel_stm32:STM32-C-64; FLASH: 256KB; PARTNO: mcu-lqfp-64-stm32; PART_NR: STM32F105RCT6; RAM: 64KB
U3 = omc:BMP085: BMP085 - Digital pressure sensor - Temperature measurement included - I2C interface - Fully calibrated Datasheet <http://www.sparkfun.com/datasheets/Components/General/BST-BMP085-DS000-05.pdf>; DNP: T; PARTNO: sensr-clcc-8-baro
U$1 = quadshot:TR-LOGO; BOM: EXCLUDE; PARTNO: *
VREG1 = paparazzi:MIC5209; PARTNO: vreg-so8-3v3

## Net classes
0 default: width 0.152 mm, drill 0.305 mm, clearance 0.152 mm